# EAGLE design E180-Z8910SX (EAGLE 9.6.2)
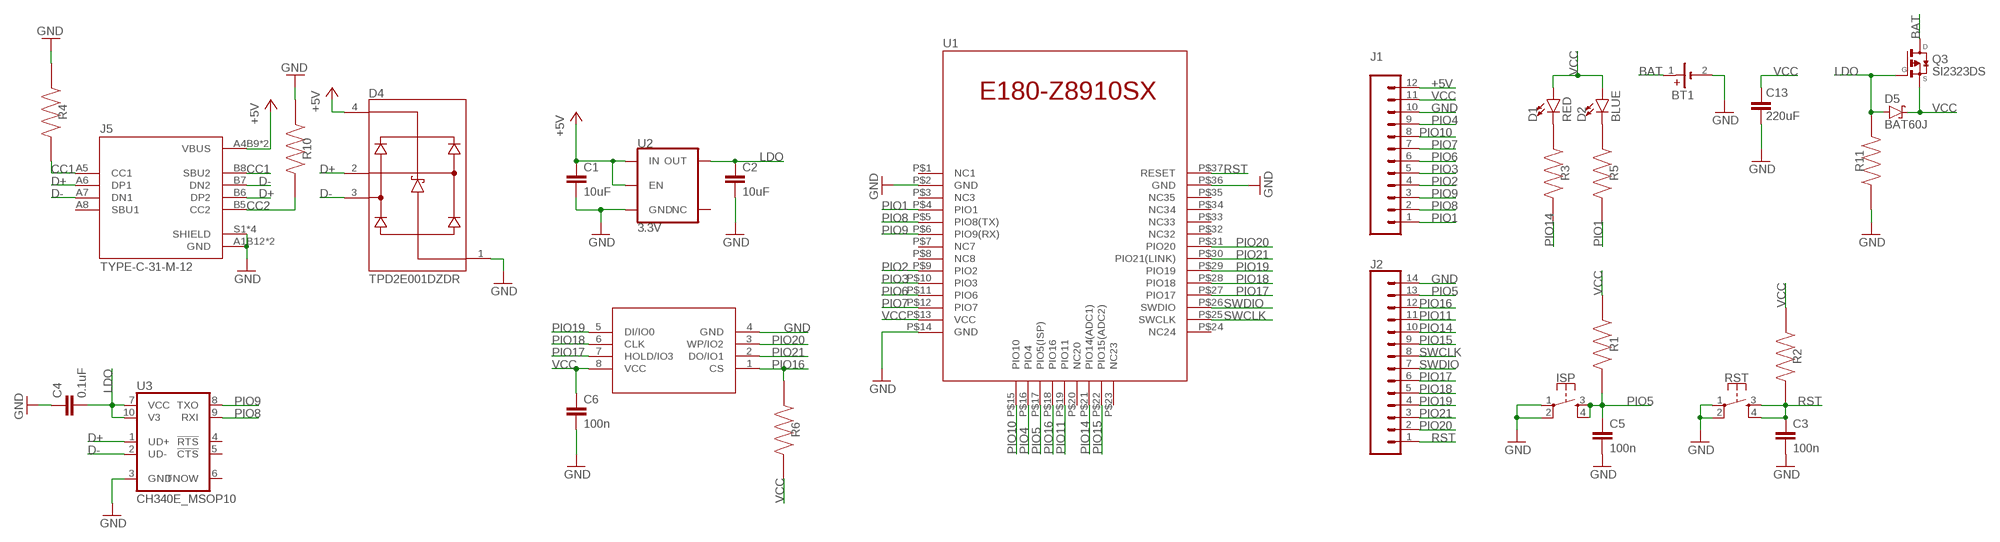
[diagram p0: schematic, sheet 1]

## Parts
BT1  79527141  [79527141]
C1  10uF  10UF-0603-6.3V-20%  [0603]
C2  10uF  10UF-0603-6.3V-20%  [0603]
C3  100n  0.1UF-0603-25V-5%  [0603]
C4  0.1uF  0.1UF-0603-25V-(+80/-20%)  [0603]
C5  100n  0.1UF-0603-25V-5%  [0603]
C6  100n  0.1UF-0603-25V-5%  [0603]
C13  220uF  C_TANTALUM-2917(7343-METRIC)  [CAPM7343X310]
D1  RED  LED-RED0603  [LED-0603]
D2  BLUE  LED-GREEN0603  [LED-0603]
D4  TPD2E001DZDR  [SOT192P237X122-4N]
D5  BAT60J  [SOD323_ST]
ISP  MOMENTARY-SWITCH-SPST-2-SMD-4.6X2.8MM  [TACTILE_SWITCH_SMD_4.6X2.8MM]
J1  CONN_12NO_SILK  [1X12_NO_SILK]
J2  CONN_14NO_SILK  [1X14_NO_SILK]
J5  TYPE-C-31-M-12  [HRO_TYPE-C-31-M-12]
Q3  SI2323DS  [SOT23]
R1  10k  RC0402FR-073M6L  [RESC1005X40N]
R2  10k  RC0402FR-073M6L  [RESC1005X40N]
R3  2k  RC0402FR-073M6L  [RESC1005X40N]
R4  5.1k  RC0402FR-073M6L  [RESC1005X40N]
R5  2k  RC0402FR-073M6L  [RESC1005X40N]
R6  100k  RC0402FR-073M6L  [RESC1005X40N]
R10  5.1k  RC0402FR-073M6L  [RESC1005X40N]
R11  10k  RC0402FR-073M6L  [RESC1005X40N]
RST  MOMENTARY-SWITCH-SPST-2-SMD-4.6X2.8MM  [TACTILE_SWITCH_SMD_4.6X2.8MM]
U1  E180-Z8910SXE180-Z8910SP  [E180-Z8910SX]
U2  3.3V  V_REG_AP2112K-3.3V  [SOT23-5]
U3  CH340E_MSOP10  [MSOP10]
U$1  W25Q80DVSNIG  W25Q80BVSNIG  [SO-8]

## Nets
+5V: C1.1 D4.4(VCC) J1.12 J5.A4B9(VBUS) J5.B4A9(VBUS) U2.1(IN) U2.3(EN)
BAT: BT1.1(+) Q3.3(D)
CC1: J5.A5(CC1) J5.B8(SBU2) R4.2
CC2: J5.B5(CC2) R10.2
D+: D4.2(IO1) J5.A6(DP1) J5.B6(DP2) U3.1(UD+)
D-: D4.3(IO2) J5.A7(DN1) J5.B7(DN2) U3.2(UD-)
GND: BT1.2(-) C1.2 C2.2 C3.2 C4.1 C5.2 C6.2 C13.2 D4.1(GND) ISP.1 ISP.2 J1.10 J2.14 J5.A1B12(GND) J5.B1A12(GND) J5.S1(SHIELD) J5.S2(SHIELD) J5.S3(SHIELD) J5.S4(SHIELD) R4.1 R10.1 R11.1 RST.1 RST.2 U1.P$2(GND) U1.P$14(GND) U1.P$36(GND) U2.2(GND) U3.3(GND) U$1.4(GND)
LDO: C2.1 C4.2 D5.A Q3.1(G) R11.2 U2.5(OUT) U3.7(VCC) U3.10(V3)
N$1: D1.C R3.1
N$4: D2.C R5.1
PIO1: J1.1 R5.2 U1.P$4(PIO1)
PIO2: J1.4 U1.P$9(PIO2)
PIO3: J1.5 U1.P$10(PIO3)
PIO4: J1.9 U1.P$16(PIO4)
PIO5: C5.1 ISP.3 ISP.4 J2.13 R1.2 U1.P$17(PIO5(ISP))
PIO6: J1.6 U1.P$11(PIO6)
PIO7: J1.7 U1.P$12(PIO7)
PIO8: J1.2 U1.P$5(PIO8(TX)) U3.9(RXI)
PIO9: J1.3 U1.P$6(PIO9(RX)) U3.8(TXO)
PIO10: J1.8 U1.P$15(PIO10)
PIO11: J2.11 U1.P$19(PIO11)
PIO14: J2.10 R3.2 U1.P$21(PIO14(ADC1))
PIO15: J2.9 U1.P$22(PIO15(ADC2))
PIO16: J2.12 R6.1 U1.P$18(PIO16) U$1.1(CS)
PIO17: J2.6 U1.P$27(PIO17) U$1.7(HOLD/IO3)
PIO18: J2.5 U1.P$28(PIO18) U$1.6(CLK)
PIO19: J2.4 U1.P$29(PIO19) U$1.5(DI/IO0)
PIO20: J2.2 U1.P$31(PIO20) U$1.3(WP/IO2)
PIO21: J2.3 U1.P$30(PIO21(LINK)) U$1.2(DO/IO1)
RST: C3.1 J2.1 R2.2 RST.3 RST.4 U1.P$37(RESET)
SWCLK: J2.8 U1.P$25(SWCLK)
SWDIO: J2.7 U1.P$26(SWDIO)
VCC: C6.1 C13.1 D1.A D2.A D5.C J1.11 Q3.2(S) R1.1 R2.1 R6.2 U1.P$13(VCC) U$1.8(VCC)
Unconnected: J5.A8(SBU1) U1.P$1(NC1) U1.P$3(NC3) U1.P$7(NC7) U1.P$8(NC8) U1.P$20(NC20) U1.P$23(NC23) U1.P$24(NC24) U1.P$32(NC32) U1.P$33(NC33) U1.P$34(NC34) U1.P$35(NC35) U2.4(NC) U3.4(!RTS) U3.5(!CTS) U3.6(TNOW)

## Library data of the parts
BT1 = Battery Holder_2:79527141: BATTERY HOLDER COIN 20MM SMD Manufacturer's datasheet <https://katalog.we-online.de/em/datasheet/79527141.pdf>; CREATED_BY: PCBLayout.com; DIGIKEY_PART_NO: 732-12325-2-ND; MANUFACTURER: Wurth Electronics Inc.; MPN: 79527141
C1 C2 = SparkFun-Capacitors:10UF: 10.0µF ceramic capacitors A capacitor is a passive two-terminal electrical component used to store electrical energy temporarily in an electric field.; PROD_ID: CAP-11015
C3 C5 C6 = SparkFun-Capacitors:0.1UF: 0.1µF ceramic capacitors A capacitor is a passive two-terminal electrical component used to store electrical energy temporarily in an electric field.; PROD_ID: CAP-08604; VALUE: 0.1uF
C4 = SparkFun-Capacitors:0.1UF: 0.1µF ceramic capacitors A capacitor is a passive two-terminal electrical component used to store electrical energy temporarily in an electric field.; PROD_ID: CAP-00810
C13 = Capacitor:C: Capacitor - Generic; CATEGORY: Capacitor
D1 = SparkFun-LED:LED-RED: Red SMD LED Used in manufacturing of most products at SparkFun Packages: 0603 - SMD 0603 package [Product Link] <http://docs.avagotech.com/docs/AV02-0551EN> 0603 SMART - SMD 0603 SMART package ( more efficient and expensive)[Product Link] <http://www.osram-os.com/Graphics/XPic2/00077099_0.pdf> 1206 - SMD1206 package [Product Link] <https://www.sparkfun.com/datasheets/DevTools/LilyPad/Q150OVS4.pdff> SparkFun Products: Pro Mini 328 -5V <https://www.sparkfun.com/products/821> RedBoard <https://www.sparkfun.com/products/12757> IOIO-OTG <https://www.sparkfun.com/products/13613>; PROD_ID: DIO-00819
D2 = SparkFun-LED:LED-GREEN: Green SMD LED Used in manufacturing of various products at SparkFun Packages: 0603 - SMD 0603 package [Product Link] <http://www.futureelectronics.com/en/technologies/semiconductors/optoelectronics/leds/Pages/9894312-LTST-C190GKT.aspx?CrossPart=HSMG-C190&IM=0> LilyPad 1206 - SMD1206 LilyPad package [Product Link] <http://www.futureelectronics.com/en/Technologies/Product.aspx?ProductID=IN150NGHARVATEKCORPORATION2049943&IM=0> 1206 - SMD1206 package [Product Link] <http://www.futureelectronics.com/en/technologies/semiconductors/optoelectronics/leds/Pages/8315665-LTST-C150KGKT.aspx?IM=0> 1206 Bottom Mount -SMD 1206 Bottom Mount [Product Link] <http://www.digikey.com/product-detail/en/lite-on-inc/LTST-C230KGKT/160-1456-1-ND/386854> SparkFun Products: Pro Mini 328 -5V <https://www.sparkfun.com/products/821> RedBoard <https://www.sparkfun.com/products/12757> MP3 Trigger <https://www.sparkfun.com/products/13720> Makey Makey <https://www.sparkfun.com/products/11076>; PROD_ID: DIO-00821; VALUE: GREEN
D4 = TPD2E001DZDR:TPD2E001DZDR: Low-capacitance 2-channel +/-15k-V ESD protection array for high-speed data interfaces Check prices <https://pricing.snapeda.com/parts/TPD2E001DZDR/Texas%20Instruments/view-part?ref=eda>; AVAILABILITY: In Stock; DESCRIPTION: Low-capacitance 2-channel +/-15k-V ESD protection array for high-speed data interfaces 4-SOT-23 -40 to 85; MF: Texas Instruments; MP: TPD2E001DZDR; PACKAGE: SOT-23-4 Texas Instruments; PRICE: None; PURCHASE-URL: https://pricing.snapeda.com/search/part/TPD2E001DZDR/?ref=eda
D5 = diode:BAT60J: Schottky barrier diode Source: www.st.com, BAT60J.pdf
ISP RST = SparkFun-Switches:MOMENTARY-SWITCH-SPST-2: Momentary Switch (Pushbutton) - SPST - Two Circuits Normally-open (NO) SPST momentary switches (buttons, pushbuttons). Schematic symbol includes two switch circuits. Variants SMD-4.6MMX2.8MM - 4.60mm x 2.80mm Tactile Momentary Button Switch - Used on SparkFun SAMD21 Mini Breakout <https://www.sparkfun.com/products/13664> SMD-5.2MM - Mini Pushbutton Switch - SMD <https://www.sparkfun.com/products/8720> - Used on Arduino Pro Mini <https://www.sparkfun.com/products/11114>; PROD_ID: SWCH-13065
J1 = SparkFun-Connectors:CONN_12: Multi connection point. Often used as Generic Header-pin footprint for 0.1 inch spaced/style header connections On any of the 0.1 inch spaced packages, you can populate with these: Break Away Headers - Straight <https://www.sparkfun.com/products/116> (PRT-00116) Break Away Male Headers - Right Angle <https://www.sparkfun.com/products/553> (PRT-00553) Female Headers <https://www.sparkfun.com/products/115> (PRT-00115) Break Away Headers - Machine Pin <https://www.sparkfun.com/products/117> (PRT-00117) Break Away Female Headers - Swiss Machine Pin <https://www.sparkfun.com/products/743> (PRT-00743) For SCREWTERMINALS and SPRING TERMINALS visit here: Screw Terimnals on SparkFun.com <https://www.sparkfun.com/search/results?term=Screw+Terminals> (5mm/3.5mm/2.54mm spacing) This device is also useful as a general connection point to wire up your design to another part of your project. Our various solder wires solder well into these plated through hole pads. Hook-Up Wire - Assortment (Stranded, 22 AWG) <https://www.sparkfun.com/products/11375> (PRT-11375) Hook-Up Wire - Assortment (Solid Core, 22 AWG) <https://www.sparkfun.com/products/11367> (PRT-11367) View the entire wire category on our website here <https://www.sparkfun.com/categories/141> Special notes: Molex polarized connector foot print use with SKU : PRT-08231 with associated crimp pins and housings. 1MM SMD Version SKU: PRT-10208 NOTES ON THE VARIANTS LOCK and LOCK_LONGPADS... This footprint was designed to help hold the alignment of a through-hole component (i.e. 6-pin header) while soldering it into place. You may notice that each hole has been shifted either up or down by 0.005 of an inch from it's more standard position (which is a perfectly straight line). This slight alteration caused the pins (the squares in the middle) to touch the edges of the holes. Because they are alternating, it causes a "brace" to hold the component in place. 0.005 has proven to be the perfect amount of "off-center" position when using our standard breakaway headers. Although looks a little odd when you look at the bare footprint, once you have a header in there, the alteration is very hard to notice. Also,if you push a header all the way into place, it is covered up entirely on the bottom side.
J2 = SparkFun-Connectors:CONN_14: Multi connection point. Often used as Generic Header-pin footprint for 0.1 inch spaced/style header connections On any of the 0.1 inch spaced packages, you can populate with these: Break Away Headers - Straight <https://www.sparkfun.com/products/116> (PRT-00116) Break Away Male Headers - Right Angle <https://www.sparkfun.com/products/553> (PRT-00553) Female Headers <https://www.sparkfun.com/products/115> (PRT-00115) Break Away Headers - Machine Pin <https://www.sparkfun.com/products/117> (PRT-00117) Break Away Female Headers - Swiss Machine Pin <https://www.sparkfun.com/products/743> (PRT-00743) For SCREWTERMINALS and SPRING TERMINALS visit here: Screw Terimnals on SparkFun.com <https://www.sparkfun.com/search/results?term=Screw+Terminals> (5mm/3.5mm/2.54mm spacing) This device is also useful as a general connection point to wire up your design to another part of your project. Our various solder wires solder well into these plated through hole pads. Hook-Up Wire - Assortment (Stranded, 22 AWG) <https://www.sparkfun.com/products/11375> (PRT-11375) Hook-Up Wire - Assortment (Solid Core, 22 AWG) <https://www.sparkfun.com/products/11367> (PRT-11367) View the entire wire category on our website here <https://www.sparkfun.com/categories/141> Special notes: Molex polarized connector foot print use with SKU : PRT-08231 with associated crimp pins and housings. 1MM SMD Version SKU: PRT-10208 NOTES ON THE VARIANTS LOCK and LOCK_LONGPADS... This footprint was designed to help hold the alignment of a through-hole component (i.e. 6-pin header) while soldering it into place. You may notice that each hole has been shifted either up or down by 0.005 of an inch from it's more standard position (which is a perfectly straight line). This slight alteration caused the pins (the squares in the middle) to touch the edges of the holes. Because they are alternating, it causes a "brace" to hold the component in place. 0.005 has proven to be the perfect amount of "off-center" position when using our standard breakaway headers. Although looks a little odd when you look at the bare footprint, once you have a header in there, the alteration is very hard to notice. Also,if you push a header all the way into place, it is covered up entirely on the bottom side.
J5 = TYPE-C-31-M-12:TYPE-C-31-M-12: USB Connectors 24 Receptacle 1 8.94*7.3mm RoHS; AVAILABILITY: Unavailable; DESCRIPTION: USB Connectors 24 Receptacle 1 8.94*7.3mm RoHS; MF: HRO Electronics Co., Ltd.; MP: TYPE-C-31-M-12; PACKAGE: Package; PRICE: None
Q3 = SI2323DS:SI2323DS: P-Channel MOSFET; AVAILABILITY: Unavailable; DESCRIPTION: P-Channel 20V 3.7A (Ta) 750mW (Ta) Surface Mount SOT-23-3 (TO-236); MF: Vishay Siliconix; MP: SI2323DS; PACKAGE: SOT-23-3 Vishay Siliconix; PRICE: None
R1-R6 R10 R11 = RC0402FR-073M6L:RC0402FR-073M6L: RESISTOR, 0402 0.063W 1% 3M6; Resistance:3.6Mohm; Resistance Tolerance:± 1%; Power Rating:0.063W; Voltage Rating:50V; Series:RC32H; Temperature Coefficient:± 100ppm/°C; Resistor Element Type:Thick Film; Resistor Case Style:0402; No. of Pins:2; SVHC:No SVHC; Case Style:0402; External Length / Height:1mm; Temperature Coeff. +:100ppm/°C; Temperature Coeff. -:100ppm/°C; External Depth:0.35mm; External Width:0.5mm; Operating Temperature Range:-55°C to +155°C; Overload Voltage:100V Check prices <https://pricing.snapeda.com/parts/RC0402FR-073M6L/Yageo/view-part?ref=eda>; AVAILABILITY: Good; DESCRIPTION: RESISTOR, 0402 0.063W 1% 3M6; Resistance:3.6Mohm; Resistance Tolerance:± 1%; Power Rating:0.063W; Voltage Rating:50V; Series:RC32H; Temperature Coefficient:± 100ppm/°C; Resistor Element Type:Thick Film; Resistor Case Style:0402; No. of Pins:2; SVHC:No SVHC; Case Style:0402; External Length / Height:1mm; Temperature Coeff. +:100ppm/°C; Temperature Coeff. -:100ppm/°C; External Depth:0.35mm; External Width:0.5mm; Operating Temperature Range:-55°C to +155°C; Overload Voltage:100V; MF: Yageo; MP: RC0402FR-073M6L; PACKAGE: 1005 Panasonic Electronic Components; PRICE: None; PURCHASE-URL: https://pricing.snapeda.com/search/part/RC0402FR-073M6L/?ref=eda
U1 = E180-Z8910SP:E180-Z8910SX
U2 = SparkFun-IC-Power:V_REG_AP2112: AP2112 - 600mA CMOS LDO Regulator w/ Enable The AP2112 is CMOS process low dropout linear regulator with enable function, the regulator delivers a guaranteed 600mA (min.) continuous load current. Features Output Voltage Accuracy: ±1.5% Output Current: 600mA (Min.) Foldback Short Current Protection: 50mA Enable Function to Turn ON/OFF VOUT Low Dropout Voltage (3.3V): 250mV (Typ.) @IOUT=600mA Excellent Load Regulation: 0.2%/A (Typ.) Excellent Line Regulation: 0.02%/V (Typ.) Low Quiescent Current: 55μA (Typ.) Low Standby Current: 0.01μA (Typ.) Low Output Noise: 50μVRMS PSRR: 100Hz -65dB, 1kHz -65dB OTSD Protection Stable with 1.0μF Flexible Cap: Ceramic, Tantalum and Aluminum Electrolytic Operation Temperature Range: -40°C to 85°C ESD: MM 400V, HBM 4000V; PROD_ID: VREG-12457
U3 = CH340E:CH340E: Check prices <https://pricing.snapeda.com/parts/CH340E/WCH/view-part?ref=eda>; AVAILABILITY: Not in stock; DESCRIPTION: USB to serial chip CH340; MF: WCH; MP: CH340E; PACKAGE: Package; PRICE: None
U$1 = W25Q80BVSNIG:W25Q80BVSNIG: Check availability <https://pricing.snapeda.com/parts/W25Q80BVSNIG/Winbond%20Electronics/view-part?ref=eda>; AVAILABILITY: In Stock; DESCRIPTION: FLASH - NOR Memory IC 8Mb (1M x 8) SPI - Quad I/O 104 MHz 8-SOIC; MF: Winbond Electronics; MP: W25Q80BVSNIG; PACKAGE: SOIC-8 Winbond; PRICE: None

## Net classes
0 default: clearance 0.205 mm

## Board
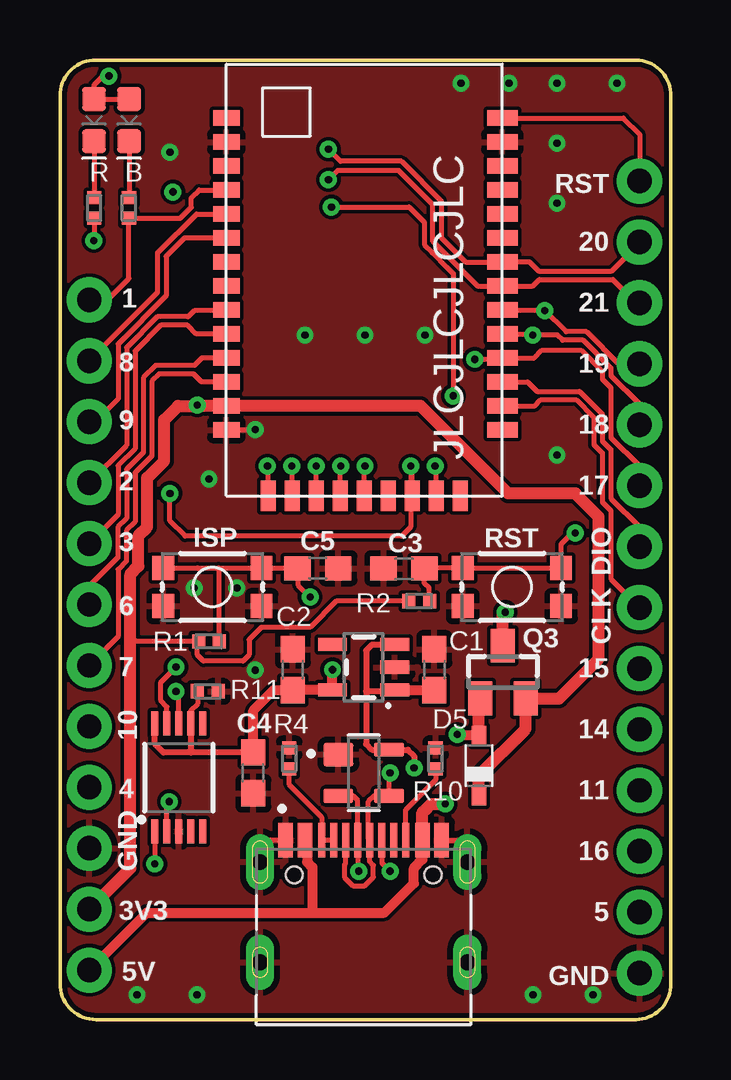
[diagram p1: board, top side]
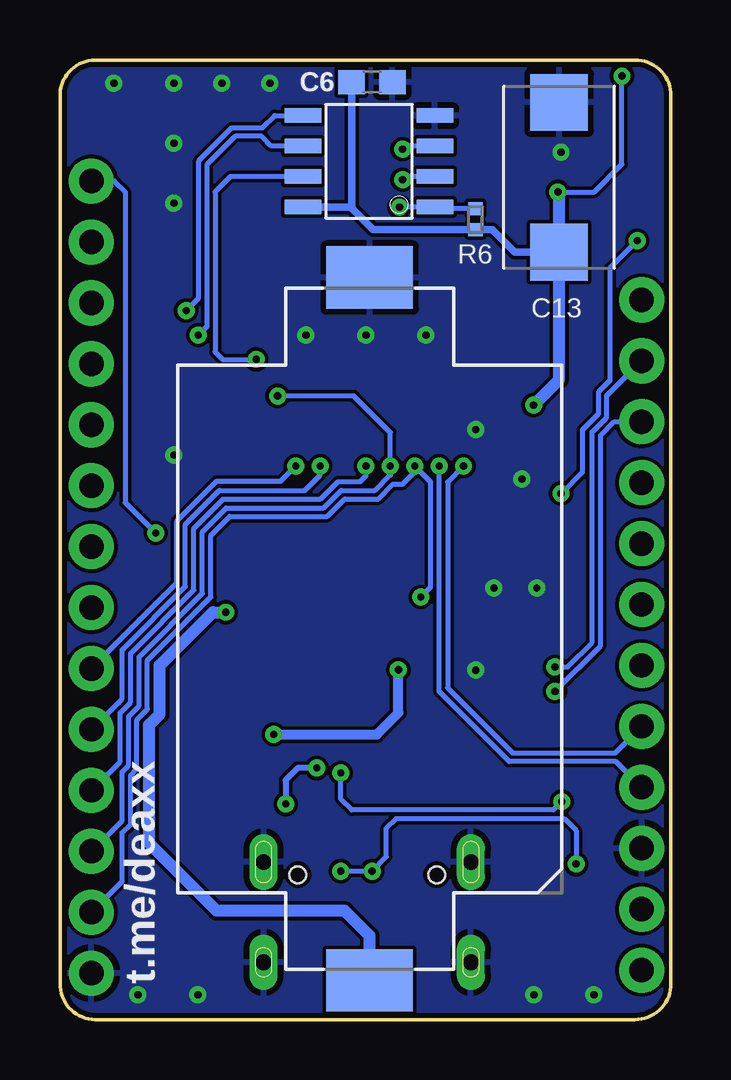
[diagram p2: board, bottom side, seen from below]

Size 25.46 x 40 mm. Coordinates in mm from the lower left corner, seen from the top.
Outline: 0,38.5 arc-90 1.5,40 24,40 arc-90 25.46,38.49 25.46,1.49 arc-90 24,0 1.5,0 arc-90 0,1.5 0,38.5
Copper layers (1*16): Top 0.035mm / dielectric 1.5mm / Bottom 0.035mm
Design rules "default *": minimum track width 0.2mm, minimum drill 0.3mm, track to track 6mil, track to pad 6mil, pad to pad 6mil, via to via 6mil, smd to smd 6mil, copper to edge 0.2mm, drill to drill 0.3mm, minimum pad ring 10mil, minimum via ring 8mil, stop-mask expansion 4mil, vias tented up to drill 0.3mm, thermal gap 10mil

### Footprints (pad centres in the part's own frame; a part is rotated, then mirrored left to right if it is on the bottom)
79527141 = smd 2.6 x 3.6: 1 -14.65,0; 2 14.65,0
0603 = smd 1.1 x 1: 1 -0.85,0; 2 0.85,0
CAPM7343X310 = smd 2.368 x 2.404: 1 -3.121,0; 2 3.121,0
LED-0603 = smd 1 x 1: A -0.877,0; C 0.877,0
SOT192P237X122-4N = smd 1.24 x 0.99: 1 -1.055,0.76 | smd 1.24 x 0.59: 2 -1.055,-0.96; 3 1.055,-0.96; 4 1.055,0.96
SOD323_ST = smd 0.8 x 0.6: A 1.25,0; C -1.25,0
TACTILE_SWITCH_SMD_4.6X2.8MM = smd 0.9 x 1: 1 -2.05,-0.8; 2 2.05,-0.8; 3 2.05,0.8; 4 -2.05,0.8
1X12_NO_SILK = drill 1.016 pad 1.88: 1 0,0; 2 2.54,0; 3 5.08,0; 4 7.62,0; 5 10.16,0; 6 12.7,0; 7 15.24,0; 8 17.78,0; 9 20.32,0; 10 22.86,0; 11 25.4,0; 12 27.94,0
1X14_NO_SILK = drill 1.016 pad 1.88: 1 0,0; 2 2.54,0; 3 5.08,0; 4 7.62,0; 5 10.16,0; 6 12.7,0; 7 15.24,0; 8 17.78,0; 9 20.32,0; 10 22.86,0; 11 25.4,0; 12 27.94,0; 13 30.48,0; 14 33.02,0
HRO_TYPE-C-31-M-12 = smd 0.6 x 1.45: A1B12 -3.25,5.095; A4B9 -2.45,5.095; B1A12 3.25,5.095; B4A9 2.45,5.095 | smd 0.3 x 1.45: A5 -1.25,5.095; A6 -0.25,5.095; A7 0.25,5.095; A8 1.25,5.095; B5 1.75,5.095; B6 0.75,5.095; B7 -0.75,5.095; B8 -1.75,5.095 | drill 0.65 pad 1.05 long: S1 -4.32,4.18; S2 4.32,4.18; S3 -4.32,0; S4 4.32,0 | hole 0.7: -2.89,3.65; 2.89,3.65
SOT23 = smd 1 x 1.4: 1 -0.95,-1.1; 2 0.95,-1.1; 3 0,1.1
RESC1005X40N = smd 0.54 x 0.6: 1 -0.432,0; 2 0.432,0
E180-Z8910SX = smd 1.1 x 0.635: P$1 -5.75,7; P$2 -5.75,6; P$3 -5.75,5; P$4 -5.75,4; P$5 -5.75,3; P$6 -5.75,2; P$7 -5.75,1; P$8 -5.75,0; P$9 -5.75,-1; P$10 -5.75,-2; P$11 -5.75,-3; P$12 -5.75,-4; P$13 -5.75,-5; P$14 -5.75,-6 | smd 0.635 x 1.27: P$15 -4,-8.75; P$16 -3,-8.75; P$17 -2,-8.75; P$18 -1,-8.75; P$19 0,-8.75; P$20 1,-8.75; P$21 2,-8.75; P$22 3,-8.75; P$23 4,-8.75 | smd 1.27 x 0.635: P$24 5.75,-6; P$25 5.75,-5; P$26 5.75,-4; P$27 5.75,-3; P$28 5.75,-2; P$29 5.75,-1; P$30 5.75,0; P$31 5.75,1; P$32 5.75,2; P$33 5.75,3; P$34 5.75,4; P$35 5.75,5; P$36 5.75,6; P$37 5.75,7
SOT23-5 = smd 0.55 x 1.2: 1 -0.95,-1.3; 2 0,-1.3; 3 0.95,-1.3; 4 0.95,1.3; 5 -0.95,1.3
MSOP10 = smd 1 x 0.3: 1 -2.25,1; 2 -2.25,0.5; 3 -2.25,0; 4 -2.25,-0.5; 5 -2.25,-1; 6 2.25,-1; 7 2.25,-0.5; 8 2.25,0; 9 2.25,0.5; 10 2.25,1
SO-8 = smd 1.524 x 0.61: 1 -2.743,1.27; 2 -2.743,0; 3 -2.743,-1.27; 4 -2.743,-2.54; 5 2.743,-2.54; 6 2.743,-1.27; 7 2.743,0; 8 2.743,1.27

### Placement (x,y rotation side)
BT1  12.55,16.28 90 bottom
C1  15.6,14.58 90 top
C2  9.7,14.58 90 top
C3  14.33,18.8 180 top
C4  8.05,10.28 90 top
C5  10.74,18.8 0 top
C6  12.45,39.08 0 bottom
C13  4.66,35.11 90 bottom
D1  1.42,37.49 270 top
D2  2.88,37.49 270 top
D4  12.65,10.28 0 top
D5  17.45,10.58 90 top
ISP  6.35,18.03 0 top
J1  1.22,30 270 top
J2  24.15,34.95 270 top
J5  12.65,2.38 0 top
Q3  18.45,14.48 0 top
R1  6.21,15.76 0 top
R2  14.97,17.44 0 top
R3  1.43,33.83 270 top
R4  9.55,10.88 270 top
R5  2.87,33.83 270 top
R6  8.14,33.36 270 bottom
R10  15.65,10.88 270 top
R11  6.15,13.68 180 top
RST  18.83,18.03 0 top
U1  12.68,30.58 0 top
U2  12.65,14.68 90 top
U3  4.95,10.08 90 top
U$1  12.58,35.14 180 bottom

### Tracks (layer width: path | path; a pad name or v marks a point on that pad's centre or on a via)
+5V  (via drill 0.3)
  Top 0.254: U2.3 13,15.63 12.75,15.38 12.75,13.68 | 12.75,13.68 12.75,11.48 12.99,11.24 D4.4 14.49,11.24 14.75,10.98 v14.75,10.48 | U2.1 13.9,13.68 12.75,13.68
  Top 0.406: U2.1 C1.1 | J5.A4B9 10.29,7.39 10.29,6.57 10.52,6.35 10.52,4.45 | J5.B4A9 15.1,6.67 14.74,6.31 14.74,5.68 13.51,4.45 10.52,4.45 | 10.52,4.45 3.61,4.45 J1.12
  Top 0.508: J5.B4A9 15.1,8.63 15.25,8.78 15.26,8.78 15.47,8.98 v16.05,8.98
  Bottom 0.254: v14.75,10.48 15.55,10.48 16.05,9.98 v16.05,8.98
BAT  (via drill 0.3)
  Top 0.508: Q3.3 18.45,16.88 v18.55,16.98
  Bottom 0.508: BT1.1 12.55,3.49 13.6,4.53 18.93,4.53 21.74,7.34 21.74,12.29 21.3,12.72 21.3,14.76 19.09,16.98 v18.55,16.98
CC1
  Top 0.2: J5.A5 J5.B8 10.9,8.43 9.55,9.78 R4.2
CC2
  Top 0.2: J5.B5 14.4,8.73 15.65,9.98 R10.2
D+  (via drill 0.3)
  Top 0.2: v12.45,6.18 12.4,6.23 J5.A6 12.4,9.13 12.21,9.32 D4.2 | J5.B6 13.41,6.53 v13.75,6.18 | U3.1 v3.95,6.48
  Bottom 0.2: v13.75,6.18 v12.45,6.18 11.85,6.78 11.85,7.98 11.45,8.38 4.45,8.38 3.95,7.88 v3.95,6.48
D-  (via drill 0.3)
  Top 0.2: J5.B7 11.9,6.49 11.85,6.43 11.85,5.93 12.2,5.58 12.7,5.58 13.06,5.93 13.06,6.43 12.9,6.59 J5.A7 12.85,7.53 12.85,9.08 13.09,9.32 D4.3 13.71,10.24 v13.75,10.28 | U3.2 4.45,8.98 v4.55,9.08
  Bottom 0.2: v4.55,9.08 4.9,8.74 13.31,8.74 13.75,9.18 v13.75,10.28
GND  (via drill 0.3)
  Top 0.2: J5.B1A12 16.76,7.48 16.97,7.26 J5.S2 | J5.A1B12 8.65,7.48 8.25,7.08 8.25,6.64 J5.S1 | U1.P$14 6.95,24.6 v8.14,24.6
  Top 0.406: J5.A1B12
  other vias: 4.58,36.16 12.71,28.54 7.37,18 5.6,18 8.14,14.57 16.71,39.04 18.71,39.04 20.71,39.04 23.21,39.04 20.71,36.54 20.71,34.04 20.71,23.54 6.21,22.54 3.21,1.04 5.71,1.04 19.71,1.04 22.21,1.04 10.21,28.54 15.21,28.54
  pour Top: -0.4,40.41 -0.4,-0.89 25.95,-0.89 25.95,40.41
  pour Bottom: -0.6,40.25 -0.6,-0.57 25.75,-0.57 25.75,40.25
LDO  (via drill 0.3)
  Top 0.2: U3.7 5.45,12.88 5.75,13.18 5.75,13.65 R11.2
  Top 0.254: C4.2 5.45,11.13 | 5.45,11.13 4.3,11.13 3.95,11.48 U3.10 | U3.7 5.45,11.13
  Top 0.406: C4.2 8.05,12.88 8.9,13.73 C2.1 U2.5 v11.35,14.58 | v11.35,14.58 | D5.A 16.6,11.83 v16.55,11.88
  Top 0.508: D5.A 17.45,13.33 Q3.1
  Bottom 0.406: v16.55,11.88 12.25,11.88 11.35,12.78 v11.35,14.58
N$1
  Top 0.2: D1.C R3.1
N$4
  Top 0.2: D2.C 2.88,34.27 R5.1
PIO1
  Top 0.2: J1.1 1.98,30 2.87,30.89 R5.2 5.01,33.4 5.47,33.86 5.47,34.25 5.8,34.58 U1.P$4
PIO2
  Top 0.2: J1.4 2.77,23.93 2.77,28.02 4.05,29.3 5.34,29.3 5.6,29.55 6.9,29.55 U1.P$9
PIO3
  Top 0.2: U1.P$10 5.68,28.58 5.31,28.95 4.2,28.95 3.13,27.87 3.13,23.79 2.42,23.08 2.42,21.04 J1.5
PIO4  (via drill 0.3)
  Top 0.2: U1.P$16 9.68,23.05 v9.66,23.07
  Bottom 0.2: J1.9 2.29,10.76 6.74,10.76 9.66,13.68 v9.66,23.07
PIO5  (via drill 0.3)
  Top 0.2: U1.P$17 v10.68,23.07 | ISP.4 5.72,18.83 | 5.72,18.83 6.61,18.83 | 6.61,18.83 ISP.3 9.86,18.83 C5.1 9.91,18.78 9.91,18.12 v10.42,17.61 | 6.61,18.83 6.64,18.81 R1.2 | 5.77,18.78 5.72,18.83
  Bottom 0.2: J2.13 22.87,5.75 22.87,7.79 22.52,8.14 22.52,10.19 22.25,10.45 22.25,12.49 21.81,12.93 21.81,14.97 19.17,17.61 19.17,20.19 18.38,20.97 14.32,20.97 13.59,21.71 12.18,21.71 11.57,22.31 11.18,22.31 10.68,22.82 v10.68,23.07 10.01,22.41 10.01,18.02 v10.42,17.61
PIO6
  Top 0.2: U1.P$11 5.91,27.58 5.6,27.27 3.99,27.27 3.48,26.76 3.48,23.64 2.77,22.94 2.77,20.89 2.41,20.52 2.41,19.25 1.22,18.06 J1.6
PIO7
  Top 0.2: U1.P$12 5.9,26.58 5.57,26.91 4.13,26.91 3.83,26.61 3.83,23.5 3.13,22.79 3.13,20.74 2.76,20.38 2.76,19.11 2.42,18.77 2.42,15.96 J1.7
PIO8  (via drill 0.3)
  Top 0.2: J1.2 4.07,30.31 4.07,31.96 5.69,33.58 U1.P$5 | U3.9 4.45,13.04 4.2,13.3 4.2,14.06 v4.83,14.69
  Bottom 0.2: v4.83,14.69 4.32,14.69 3.28,15.73 3.28,24.49 2.67,25.1 2.67,26 J1.2
PIO9  (via drill 0.3)
  Top 0.2: U1.P$6 5.19,32.58 4.42,31.82 4.42,30.17 2.42,28.16 2.42,25.87 1.47,24.92 J1.3 | U3.8 4.95,13.56 v4.83,13.68
  Bottom 0.2: v4.83,13.68 2.93,15.58 2.93,24.34 2.35,24.92 J1.3
PIO10  (via drill 0.3)
  Top 0.2: U1.P$15 8.68,23.04 v8.64,23.07
  Bottom 0.2: v8.64,23.07 9.31,22.41 9.31,13.82 6.59,11.11 2.33,11.11 J1.8
PIO11  (via drill 0.3)
  Top 0.2: U1.P$19 12.68,23.05 v12.71,23.07
  Bottom 0.2: J2.11 22.95,10.74 22.95,12.79 22.52,13.22 22.52,15.27 19.88,17.91 19.88,20.48 18.68,21.68 14.61,21.68 13.88,22.41 12.96,22.41 12.71,22.66 v12.71,23.07
PIO14  (via drill 0.3)
  Top 0.2: U1.P$21 14.68,23.01 v14.61,23.07 14.61,20.54 14.23,20.15 5.21,20.15 4.58,20.79 v4.58,21.93 | R3.2 1.43,32.5 v1.41,32.47
  Bottom 0.2: J2.10 22.87,13.37 22.87,15.41 20.23,18.05 20.23,20.64 18.81,22.06 15.25,22.06 14.61,22.69 v14.61,23.07 | v1.41,32.47 2.55,31.33 2.55,26.63 3.03,26.15 3.03,25.24 3.69,24.58 3.69,22.82 v4.58,21.93
PIO15  (via drill 0.3)
  Top 0.2: U1.P$22 15.68,23.02 v15.63,23.07
  Bottom 0.2: J2.9 20.58,18.2 20.58,20.79 18.93,22.44 16.26,22.44 v15.63,23.07
PIO16  (via drill 0.3)
  Top 0.2: U1.P$18 v11.68,23.06 v11.69,23.07 | v11.31,33.87 14.54,33.87 15.18,33.24 15.18,32.31 15.5,31.98 15.5,31.96 16.14,31.33 16.16,31.33 16.39,31.09 v16.39,26
  Bottom 0.2: U$1.1 9.91,33.87 | 9.91,33.87 v11.31,33.87 | 9.91,33.87 9.84,33.79 R6.1 | J2.12 22.87,8.29 22.87,10.33 22.6,10.6 22.6,12.64 22.16,13.08 22.16,15.12 19.52,17.76 19.52,20.33 18.53,21.33 14.47,21.33 13.73,22.06 12.33,22.06 11.69,22.69 v11.69,23.07 11.69,24.47 13.22,26 v16.39,26
PIO17  (via drill 0.3)
  Top 0.2: J2.6 24.15,23.07 22.95,24.26 22.95,26.34 22.6,26.69 22.6,27.01 21.71,27.9 20.07,27.9 19.75,27.58 U1.P$27 18.37,27.52 v17.28,27.52
  Bottom 0.2: U$1.7 18.35,35.14 18.99,34.51 18.99,27.83 18.68,27.52 v17.28,27.52
PIO18  (via drill 0.3)
  Top 0.2: J2.5 24.15,25.65 22.95,26.84 22.95,27.16 21.8,28.31 20.94,28.31 20.72,28.54 v19.69,28.54 19.65,28.58 U1.P$28 18.39,28.54
  Bottom 0.2: U$1.6 16.64,36.41 17.05,36.82 18.15,36.82 19.34,35.63 19.34,28.89 v19.69,28.54
PIO19  (via drill 0.3)
  Top 0.2: J2.4 23.28,27.33 21.94,28.67 21.09,28.67 v20.2,29.55 20.17,29.58 U1.P$29 18.4,29.55
  Bottom 0.2: U$1.5 16.52,37.68 17.03,37.17 18.3,37.17 19.69,35.78 19.69,30.06 v20.2,29.55
PIO20  (via drill 0.3)
  Top 0.2: J2.2 24.15,32.35 22.99,31.2 19.95,31.2 19.57,31.58 U1.P$31 16.9,31.58 15.88,32.6 15.88,34.12 14.23,35.78 11.69,35.78 v11.18,36.28
  Bottom 0.2: U$1.3 11.06,36.41 v11.18,36.28
PIO21  (via drill 0.3)
  Top 0.2: J2.3 24.02,29.87 23.04,30.85 19.98,30.85 19.71,30.58 18.55,30.58 U1.P$30 17.4,30.58 15.53,32.45 15.53,33.98 14.5,35.01 | 14.5,35.01 14.49,35.01 | 14.5,35.01 14.11,35.39 11.56,35.39 v11.18,35.01
  Bottom 0.2: U$1.2 11.06,35.14 v11.18,35.01
RST  (via drill 0.3)
  Top 0.2: R2.2 15.38,17.47 15.38,18 15.18,18.19 C3.1 15.21,18.83 RST.4 RST.3 | U1.P$37 23.47,37.58 24.15,36.91 J2.1 | RST.3 20.93,18.88 | RST.3 20.88,19.82 21.34,20.28 v21.47,20.28
  Bottom 0.2: J2.1 23.19,34.95 22.74,34.51 22.74,21.55 v21.47,20.28
SWCLK
  Top 0.2: J2.8 22.95,18.36 22.95,21.21 22.6,21.56 22.6,23.61 22.25,23.97 22.25,25.09 21.5,25.84 20.04,25.84 19.79,25.58 U1.P$25
SWDIO
  Top 0.2: J2.7 24.15,20.53 22.95,21.72 22.95,23.76 22.6,24.11 22.6,25.24 21.65,26.19 19.88,26.19 19.49,26.58 U1.P$26
VCC  (via drill 0.3)
  Top 0.2: D2.A D1.A 1.42,38.96 1.79,39.33 v2.04,39.33 | R1.1 5.72,15.76 | 5.72,15.76 3,15.76 2.93,15.84 | R2.1 11.52,17.44 10.42,16.34 8.39,16.34 7.88,15.84 7.88,15.2 7.63,14.95 5.98,14.95 5.72,15.2 5.72,15.76
  Top 0.508: J1.11 2.93,6.31 2.93,15.84 2.93,18.56 3.27,18.9 3.27,20.17 3.63,20.53 3.63,22.58 4.34,23.29 4.34,24.99 4.93,25.58 5.76,25.58 | 5.76,25.58 U1.P$13 15.03,25.58 18.68,21.93 21.47,21.93 22.45,20.96 22.45,15.03 20.8,13.38 Q3.2 19.4,12.12 17.45,10.17 D5.C | 5.76,25.58 v5.72,25.61
  Bottom 0.2: U$1.8 15.38,33.92 | v4.71,34.5 3.19,34.5 2.04,35.65 v2.04,39.33
  Bottom 0.305: C13.1 6.51,31.99 7.45,32.93 R6.2 12.4,32.93 13.3,33.83 13.3,33.87 | 13.3,33.87 C6.1 | U$1.8 13.3,33.87
  Bottom 0.508: v4.71,34.5 4.66,34.45 C13.1 4.66,26.68 v5.72,25.61

### Text on the board
tNames: R | B | RST | 20 | 1 | 21 | 19 | 8 | 9 | 18 | JLCJLCJLCJLC | 17 | 2 | DIO | 3 | CLK | 6 | 15 | 7 | 14 | 10 | 11 | 4 | 16 | GND | 5 | 3V3 | 5V | GND
bNames: t.me/deaxx